# EasyEDA schematic SCH_shield_test_2024-03-16.json
TITLE: TBAG Procedures trainer; REV: 1.0; Date: 2024-01-04; Sheet: 1/1; Drawn By: svenhancock; Company: The Buccaneer Aviation Group
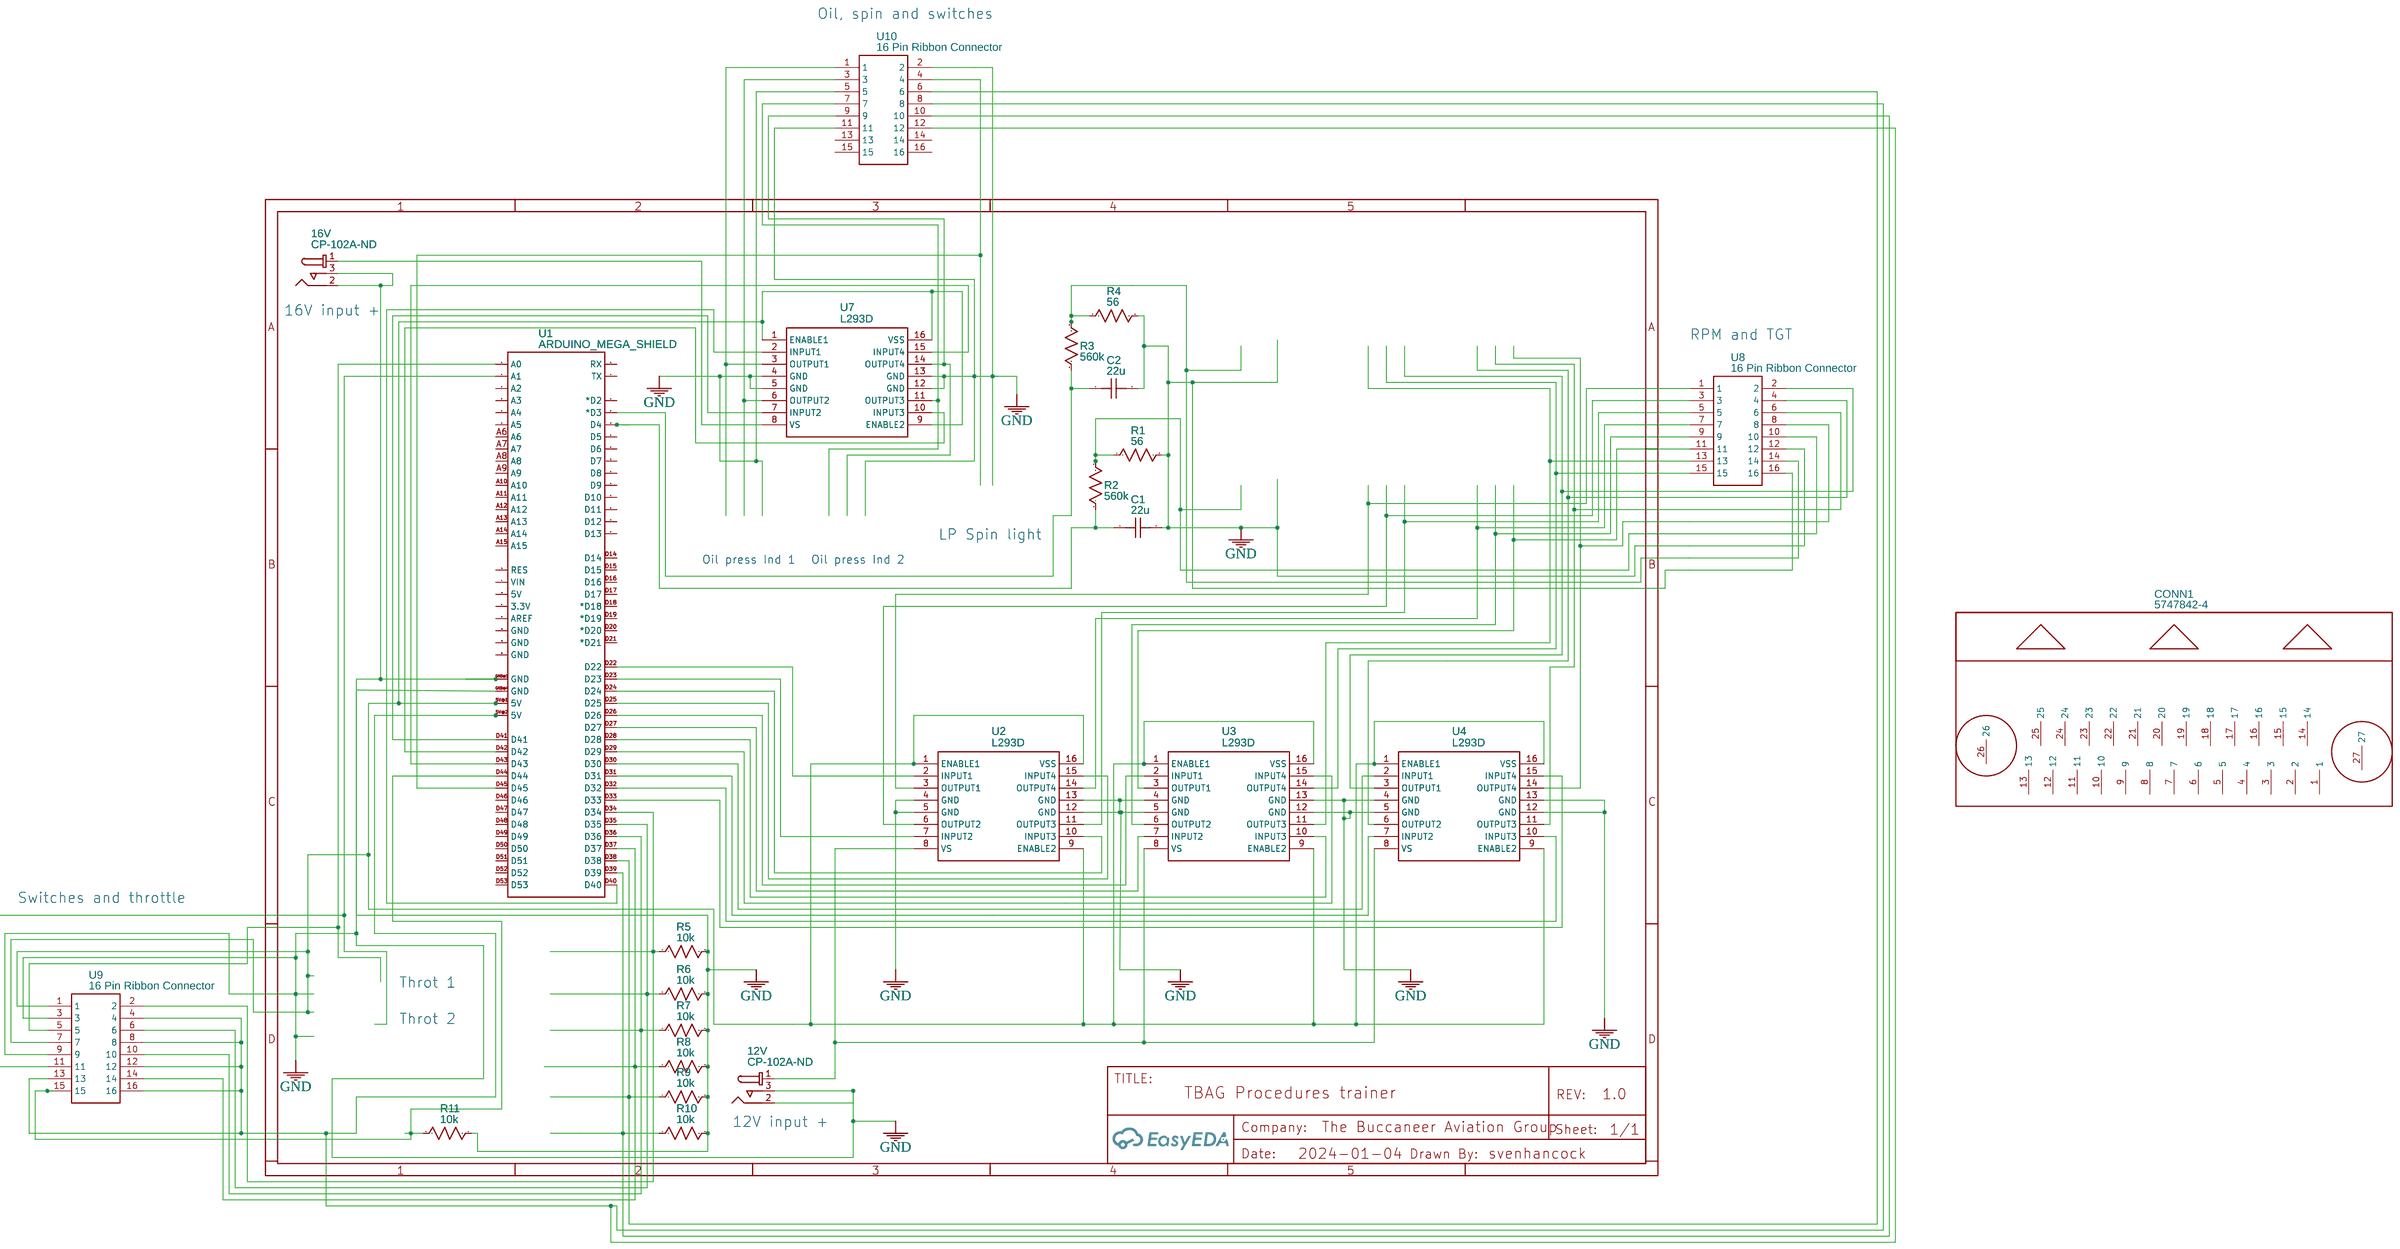
[diagram p0: schematic sheet]

## Parts
12V  CP-102A-ND  [BARREL_JACK_5.5MMODX2.1MMID_PJ-102A]
16V  CP-102A-ND  [BARREL_JACK_5.5MMODX2.1MMID_PJ-102A]
C1  22u  [C0603]
C2  22u  [C0603]
CONN1  5747842-4  [5747842-4 D-SUB 25 PIN CONNECTOR (TH)]
R1  56  [R0603]
R2  560k  [R0603]
R3  560k  [R0603]
R4  56  [R0603]
R5  10k  [R0603]
R6  10k  [R0603]
R7  10k  [R0603]
R8  10k  [R0603]
R9  10k  [R0603]
R10  10k  [R0603]
R11  10k  [R0603]
U1  ARDUINO_MEGA_SHIELD  [ARDUINO_MEGA_SHIELD]
U2  L293D  [DIP-16_L20.0-W6.4-P2.54-LS7.6-BL]
U3  L293D  [DIP-16_L20.0-W6.4-P2.54-LS7.6-BL]
U4  L293D  [DIP-16_L20.0-W6.4-P2.54-LS7.6-BL]
U7  L293D  [DIP-16_L20.0-W6.4-P2.54-LS7.6-BL]
U8  16 Pin Ribbon Connector  [16 PIN RIBBON CONNECTOR]
U9  16 Pin Ribbon Connector  [16 PIN RIBBON CONNECTOR]
U10  16 Pin Ribbon Connector  [16 PIN RIBBON CONNECTOR]

## Library data of the parts
12V 16V = CP-102A-ND: Contributor: sgpars
C1 C2 = C_0603_US: Contributor: LCEDA_Lib
CONN1 = 5747842-4: Supplier Part: A32100-ND; Supplier: Mouser; link: https://www.digikey.com/product-detail/en/te-connectivity-amp-connectors/5747842-4/A32100-ND/808655; Contributor: jwenthold
R1-R11 = R_0603_US: Contributor: LCEDA_Lib
U1 = ARDUINO_MEGA_SHIELD
U2-U4 U7 = L293D: Contributor: pitreluc; Supplier: LCSC; Manufacturer: ST(意法半导体); Supplier Part: C12340; JLCPCB Part Class: Extended Part
U8-U10 = 16 Pin Ribbon Connector: Contributor: JoseGuz

## Nets
GND: 12V.2 12V.3 16V.2 16V.3 C1.2 C2.2 R1.2 R4.2 R5.2 R6.2 R7.2 R8.2 R9.2 R10.2 R11.2 U1.GND@3(GND) U2.4(GND) U2.5(GND) U2.12(GND) U2.13(GND) U3.4(GND) U3.5(GND) U3.12(GND) U3.13(GND) U4.4(GND) U4.5(GND) U4.12(GND) U4.13(GND) U7.4(GND) U7.5(GND) U7.12(GND) U7.13(GND) U8.12 U8.16 U9.3 U9.9 U10.2 U10.5 U10.11
Net-(12V-1): 12V.1 U2.8(VS) U3.8(VS) U4.8(VS)
Net-(16V-1): 16V.1 U7.8(VS)
Net-(C1-1): C1.1 R2.1 U1.D4
Net-(C2-1): C2.1 R3.1 U1.D3(*D3)
Net-(R1-1): R1.1 R2.2 U8.10
Net-(R3-2): R3.2 R4.1 U8.14
Net-(R5-1): R5.1 U1.D34 U9.2
Net-(R6-1): R6.1 U1.D35 U9.6
Net-(R7-1): R7.1 U1.D36 U9.10
Net-(R8-1): R8.1 U1.D37 U9.14
Net-(R9-1): R9.1 U1.D38 U10.6
Net-(R10-1): R10.1 U1.D39 U10.10
Net-(R11-1): R11.1 U1.D44 U9.15
Net-(U1-5V@1): U1.5V@1(5V) U2.1(ENABLE1) U2.9(ENABLE2) U2.16(VSS) U3.1(ENABLE1) U3.9(ENABLE2) U3.16(VSS) U4.1(ENABLE1) U4.9(ENABLE2) U4.16(VSS) U7.1(ENABLE1) U7.9(ENABLE2) U7.16(VSS) U9.1 U9.7
Net-(U1-5V@2): U1.5V@2(5V) U9.4 U9.8 U9.12 U9.13 U9.16 U10.8 U10.12
Net-(U1-A0): U1.A0 U9.5
Net-(U1-A1): U1.A1 U9.11
Net-(U1-D22): U1.D22 U2.2(INPUT1)
Net-(U1-D23): U1.D23 U2.7(INPUT2)
Net-(U1-D24): U1.D24 U2.10(INPUT3)
Net-(U1-D25): U1.D25 U2.15(INPUT4)
Net-(U1-D26): U1.D26 U3.2(INPUT1)
Net-(U1-D27): U1.D27 U3.7(INPUT2)
Net-(U1-D28): U1.D28 U3.10(INPUT3)
Net-(U1-D29): U1.D29 U3.15(INPUT4)
Net-(U1-D30): U1.D30 U4.2(INPUT1)
Net-(U1-D31): U1.D31 U4.7(INPUT2)
Net-(U1-D32): U1.D32 U4.10(INPUT3)
Net-(U1-D33): U1.D33 U4.15(INPUT4)
Net-(U1-D40): U1.D40 U7.2(INPUT1)
Net-(U1-D41): U1.D41 U7.7(INPUT2)
Net-(U1-D42): U1.D42 U7.10(INPUT3)
Net-(U1-D43): U1.D43 U7.15(INPUT4)
Net-(U1-D45): U1.D45 U10.4
Net-(U2-3): U2.3(OUTPUT1) U8.1
Net-(U2-6): U2.6(OUTPUT2) U8.3
Net-(U2-11): U2.11(OUTPUT3) U8.5
Net-(U2-14): U2.14(OUTPUT4) U8.7
Net-(U3-3): U3.3(OUTPUT1) U8.11
Net-(U3-6): U3.6(OUTPUT2) U8.9
Net-(U3-11): U3.11(OUTPUT3) U8.13
Net-(U3-14): U3.14(OUTPUT4) U8.15
Net-(U4-3): U4.3(OUTPUT1) U8.2
Net-(U4-6): U4.6(OUTPUT2) U8.4
Net-(U4-11): U4.11(OUTPUT3) U8.6
Net-(U4-14): U4.14(OUTPUT4) U8.8
Net-(U7-3): U7.3(OUTPUT1) U10.1
Net-(U7-6): U7.6(OUTPUT2) U10.3
Net-(U7-11): U7.11(OUTPUT3) U10.7
Net-(U7-14): U7.14(OUTPUT4) U10.9

Not connected (* = marked no-connect by the designer): CONN1 1 2 3 4 5 6 7 8 9 10 11 12 13 14 15 16 17 18 19 20 21 22 23 24 25 26 27; U1 3.3V 5V@0(5V) A2 A3 A4 A5 A6 A7 A8 A9 A10 A11 A12 A13 A14 A15 AREF D2(*D2) D5 D6 D7 D8 D9 D10 D11 D12 D13 D14 D15 D16 D17 D18(*D18) D19(*D19) D20(*D20) D21(*D21) D46 D47 D48 D49 D50 D51 D52 D53 GND@0(GND) GND@1(GND) GND@2(GND) GND@4(GND) RES RX TX VIN; U10 13 14 15 16

## Notes on the sheet
- Oil, spin and switches
- 16V input +
- RPM and TGT
- LP Spin light
- Oil press Ind 1
- Oil press Ind 2
- Switches and throttle
- Throt 1
- Throt 2
- 12V input +
